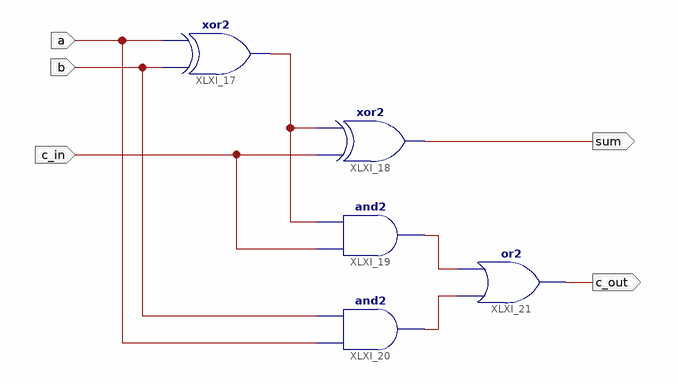
[diagram p0: schematic sheet 1]
// Xilinx ISE schematic fa_1bit.sch (spartan3e) as structural Verilog: 5 symbols, 5 ports
module fa_1bit (
  input  a,
  input  b,
  input  c_in,
  output sum,
  output c_out
);

  wire g, p, XLXN_144;

  xor XLXI_17 (p, b, a);
  xor XLXI_18 (sum, c_in, p);
  and XLXI_19 (XLXN_144, c_in, p);
  and XLXI_20 (g, a, b);
  or XLXI_21 (c_out, g, XLXN_144);
endmodule
